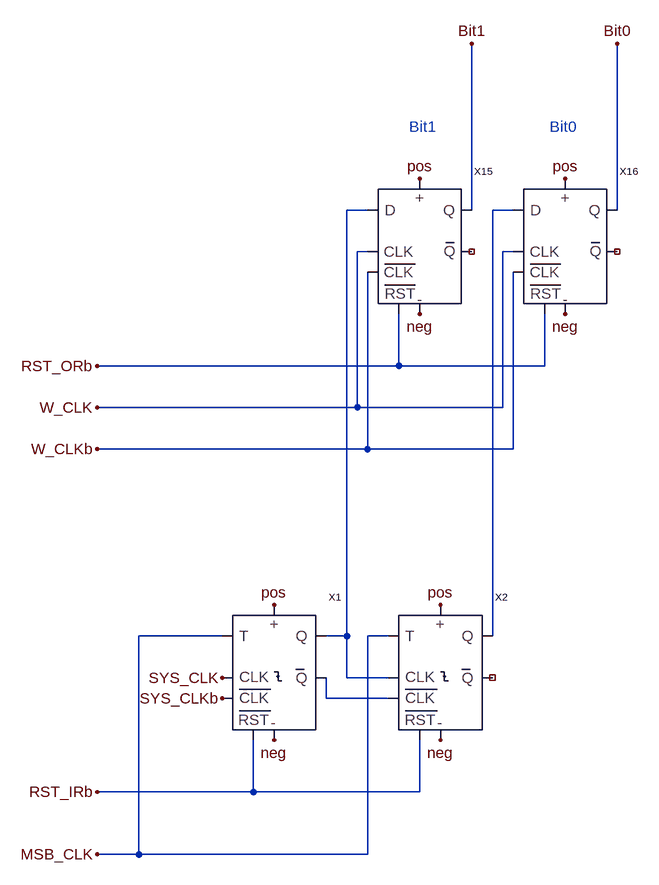
[diagram p0: schematic msb_registers.asc]
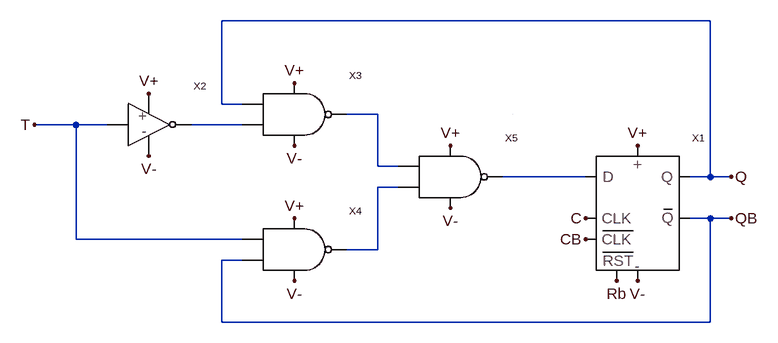
[diagram p1: sub-circuit t_flipflopreset_fe.asc]
msb_registers.asc, the LTspice schematic file:
Version 4
SHEET 1 2676 1412
WIRE -1584 336 -1616 336
WIRE -1424 336 -1424 80
WIRE -1360 336 -1392 336
WIRE -1200 336 -1200 80
WIRE -1584 400 -1600 400
WIRE -1360 400 -1376 400
WIRE -1536 576 -1536 496
WIRE -1536 576 -2000 576
WIRE -1312 576 -1312 496
WIRE -1312 576 -1536 576
WIRE -1600 640 -1600 400
WIRE -1600 640 -2000 640
WIRE -1376 640 -1376 400
WIRE -1376 640 -1600 640
WIRE -1584 704 -1584 432
WIRE -1584 704 -2000 704
WIRE -1360 704 -1360 432
WIRE -1360 704 -1584 704
WIRE -1808 992 -1936 992
WIRE -1616 992 -1616 336
WIRE -1616 992 -1648 992
WIRE -1552 992 -1584 992
WIRE -1392 992 -1392 336
WIRE -1616 1056 -1616 992
WIRE -1552 1056 -1616 1056
WIRE -1648 1088 -1648 1056
WIRE -1552 1088 -1648 1088
WIRE -1760 1232 -1760 1152
WIRE -1760 1232 -2000 1232
WIRE -1504 1232 -1504 1152
WIRE -1504 1232 -1760 1232
WIRE -1936 1328 -1936 992
WIRE -1936 1328 -2000 1328
WIRE -1584 1328 -1584 992
WIRE -1584 1328 -1936 1328
FLAG -2000 1328 MSB_CLK
FLAG -1808 1056 SYS_CLK
FLAG -1808 1088 SYS_CLKb
FLAG -2000 576 RST_ORb
FLAG -1200 80 Bit0
FLAG -1424 80 Bit1
FLAG -1504 288 pos
FLAG -1280 288 pos
FLAG -1728 944 pos
FLAG -1472 944 pos
FLAG -1504 496 neg
FLAG -1280 496 neg
FLAG -1728 1152 neg
FLAG -1472 1152 neg
FLAG -2000 640 W_CLK
FLAG -2000 704 W_CLKb
FLAG -2000 1232 RST_IRb
SYMBOL T_FlipFlopReset_FE -1760 1088 R0
SYMATTR InstName X1
SYMBOL FlipFlop -1504 400 R0
SYMATTR InstName X15
SYMATTR SpiceLine nmosL=0.9u nmosW=3u pmosL=0.9u pmosW=6u
SYMBOL FlipFlop -1280 400 R0
SYMATTR InstName X16
SYMATTR SpiceLine nmosL=0.9u nmosW=3u pmosL=0.9u pmosW=6u
SYMBOL T_FlipFlopReset_FE -1504 1088 R0
SYMATTR InstName X2
TEXT -1520 208 Left 2 ;Bit1
TEXT -1304 208 Left 2 ;Bit0

t_flipflopreset_fe.asc, the sub-circuit schematic file:
Version 4
SHEET 1 880 680
WIRE 304 -144 -448 -144
WIRE -448 -16 -448 -144
WIRE -416 -16 -448 -16
WIRE -208 0 -256 0
WIRE -672 16 -736 16
WIRE -624 16 -672 16
WIRE -416 16 -496 16
WIRE -208 80 -208 0
WIRE -176 80 -208 80
WIRE 112 96 -16 96
WIRE 304 96 304 -144
WIRE 304 96 272 96
WIRE 336 96 304 96
WIRE -176 112 -208 112
WIRE 304 160 272 160
WIRE 336 160 304 160
WIRE -672 192 -672 16
WIRE -416 192 -672 192
WIRE -208 208 -208 112
WIRE -208 208 -256 208
WIRE -416 224 -448 224
WIRE -448 320 -448 224
WIRE 304 320 304 160
WIRE 304 320 -448 320
WIRE 0 0 0 0
FLAG 112 160 C
FLAG 112 192 CB
FLAG 160 256 Rb
FLAG -336 -48 V+
FLAG -336 48 V-
FLAG -336 160 V+
FLAG -336 256 V-
FLAG 192 48 V+
FLAG 192 256 V-
FLAG -560 -32 V+
FLAG -560 64 V-
FLAG -736 16 T
FLAG 336 96 Q
FLAG 336 160 QB
FLAG -96 48 V+
FLAG -96 144 V-
SYMBOL Inverter -560 16 R0
SYMATTR InstName X2
SYMATTR SpiceLine nmosL=0.9u nmosW=3u pmosL=0.9u pmosW=6u
SYMBOL FlipFlop 192 160 R0
SYMATTR InstName X1
SYMATTR SpiceLine nmosL=0.9u nmosW=3u pmosL=0.9u pmosW=6u
SYMBOL NAND -336 0 R0
SYMATTR InstName X3
SYMATTR SpiceLine nmosL=0.9u nmosW=3u pmosL=0.9u pmosW=6u
SYMBOL NAND -336 208 R0
SYMATTR InstName X4
SYMATTR SpiceLine nmosL=0.9u nmosW=3u pmosL=0.9u pmosW=6u
SYMBOL NAND -96 96 R0
SYMATTR InstName X5
SYMATTR SpiceLine nmosL=0.9u nmosW=3u pmosL=0.9u pmosW=6u

The netlist it stands for:
* msb_registers.asc
XX1 MSB_CLK SYS_CLKb N001 N003 neg pos SYS_CLK RST_IRb t_flipflopreset_fe
XX15 N001 W_CLK W_CLKb Bit1 NC_01 RST_ORb pos neg FlipFlop nmosL=0.9u nmosW=3u pmosL=0.9u pmosW=6u  ; pins D CLK CLKb Q Qb RESETb pos neg
XX16 N002 W_CLK W_CLKb Bit0 NC_02 RST_ORb pos neg FlipFlop nmosL=0.9u nmosW=3u pmosL=0.9u pmosW=6u  ; pins D CLK CLKb Q Qb RESETb pos neg
XX2 MSB_CLK N003 N002 NC_03 neg pos N001 RST_IRb t_flipflopreset_fe

* block symbol definitions
.subckt t_flipflopreset_fe T CB Q QB V- V+ C Rb
XX2 T N002 V+ V- Inverter nmosL=0.9u nmosW=3u pmosL=0.9u pmosW=6u  ; pins IN OUT pos neg
XX1 N003 C CB Q QB Rb V+ V- FlipFlop nmosL=0.9u nmosW=3u pmosL=0.9u pmosW=6u  ; pins D CLK CLKb Q Qb RESETb pos neg
XX3 Q N001 N002 V+ V- NAND nmosL=0.9u nmosW=3u pmosL=0.9u pmosW=6u  ; pins A OUT B Vdd GROUND
XX4 T N004 QB V+ V- NAND nmosL=0.9u nmosW=3u pmosL=0.9u pmosW=6u  ; pins A OUT B Vdd GROUND
XX5 N001 N003 N004 V+ V- NAND nmosL=0.9u nmosW=3u pmosL=0.9u pmosW=6u  ; pins A OUT B Vdd GROUND
.ends t_flipflopreset_fe

* Bit1
* Bit0
.backanno
.end